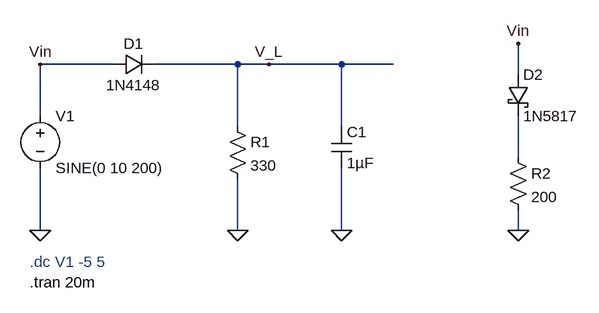
[diagram p0: schematic lab1part2.asc]
lab1part2.asc, the LTspice schematic file:
Version 4
SHEET 1 904 680
WIRE 176 48 64 48
WIRE 368 48 240 48
WIRE 416 48 368 48
WIRE 528 48 416 48
WIRE 608 48 528 48
WIRE 800 64 800 16
WIRE 64 128 64 48
WIRE 368 144 368 48
WIRE 528 144 528 48
WIRE 800 192 800 128
WIRE 64 304 64 208
WIRE 368 304 368 224
WIRE 528 304 528 208
WIRE 800 304 800 272
FLAG 64 304 0
FLAG 64 48 Vin
FLAG 368 304 0
FLAG 800 16 Vin
FLAG 800 304 0
FLAG 416 48 V_L
FLAG 528 304 0
SYMBOL voltage 64 112 R0
WINDOW 123 0 0 Left 0
WINDOW 39 0 0 Left 0
SYMATTR InstName V1
SYMATTR Value SINE(0 10 200)
SYMBOL res 352 128 R0
SYMATTR InstName R1
SYMATTR Value 330
SYMBOL diode 176 64 R270
WINDOW 0 32 32 VTop 2
WINDOW 3 0 32 VBottom 2
SYMATTR InstName D1
SYMATTR Value 1N4148
SYMBOL res 784 176 R0
SYMATTR InstName R2
SYMATTR Value 200
SYMBOL schottky 784 64 R0
SYMATTR InstName D2
SYMATTR Value 1N5817
SYMATTR Description Diode
SYMATTR Type diode
SYMBOL cap 512 144 R0
SYMATTR InstName C1
SYMATTR Value 1µF
TEXT 48 352 Left 2 ;.dc V1 -5 5
TEXT 48 384 Left 2 !.tran 20m

The netlist it stands for:
* lab1part2.asc
V1 Vin 0 SINE(0 10 200)
R1 V_L 0 330
D1 Vin V_L 1N4148
R2 N001 0 200
D2 Vin N001 1N5817
C1 V_L 0 1µF
.model D D
.lib standard.dio
* .dc V1 -5 5
.tran 20m
.backanno
.end

* Results of the author's LTspice run, read from the files saved beside the schematic
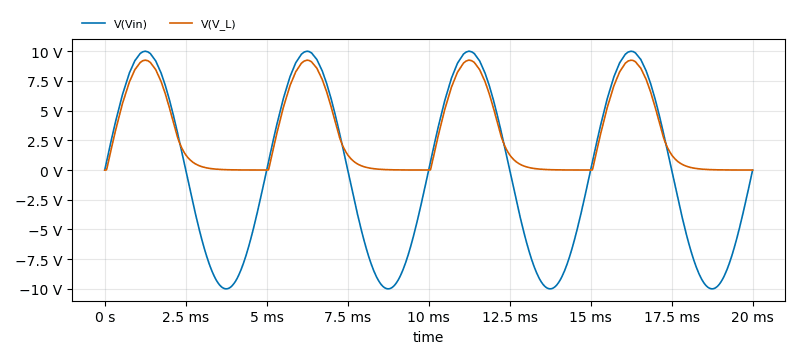
[diagram p1: Transient Analysis of lab1part2.asc, plotted from the saved traces]
* Transient Analysis, 1 run:
*   V(Vin): min -9.999 V, max 10 V, average -8.616 mV, rms 7.068 V, last 0 V
*   V(V_L): min 0 V, max 9.247 V, average 2.958 V, rms 4.556 V, last 664.6 µV